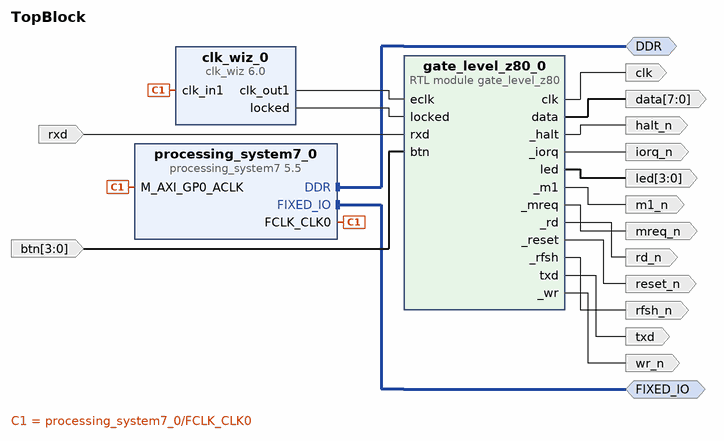
[diagram p0: block diagram of the top level]
# Vivado block design TopBlock, xc7z020clg400-1, Vivado 2019.1
create_bd_design TopBlock

create_bd_intf_port -mode Master -vlnv xilinx.com:interface:ddrx_rtl:1.0 DDR
create_bd_intf_port -mode Master -vlnv xilinx.com:display_processing_system7:fixedio_rtl:1.0 FIXED_IO
create_bd_port -dir O halt_n
create_bd_port -dir O iorq_n
create_bd_port -dir O mreq_n
create_bd_port -dir O m1_n
create_bd_port -dir O rd_n
create_bd_port -dir O rfsh_n
create_bd_port -dir O wr_n
create_bd_port -dir O -from 7 -to 0 data
create_bd_port -dir O -from 3 -to 0 led
create_bd_port -dir I rxd
create_bd_port -dir O reset_n
create_bd_port -dir O txd
create_bd_port -dir O clk
create_bd_port -dir I -from 3 -to 0 btn

create_bd_cell -type ip -vlnv xilinx.com:ip:processing_system7:5.5 processing_system7_0
set_property -dict [list \
  CONFIG.PCW_APU_PERIPHERAL_FREQMHZ 650 \
  CONFIG.PCW_CRYSTAL_PERIPHERAL_FREQMHZ 50 \
  CONFIG.PCW_ENET0_ENET0_IO {MIO 16 .. 27} \
  CONFIG.PCW_ENET0_GRP_MDIO_ENABLE 1 \
  CONFIG.PCW_ENET0_GRP_MDIO_IO {MIO 52 .. 53} \
  CONFIG.PCW_ENET0_PERIPHERAL_ENABLE 1 \
  CONFIG.PCW_ENET0_RESET_ENABLE 1 \
  CONFIG.PCW_ENET0_RESET_IO {MIO 9} \
  CONFIG.PCW_ENET_RESET_ENABLE 1 \
  CONFIG.PCW_ENET_RESET_SELECT {Share reset pin} \
  CONFIG.PCW_FPGA0_PERIPHERAL_FREQMHZ 100 \
  CONFIG.PCW_FPGA1_PERIPHERAL_FREQMHZ 31.25 \
  CONFIG.PCW_GPIO_MIO_GPIO_ENABLE 1 \
  CONFIG.PCW_GPIO_MIO_GPIO_IO MIO \
  CONFIG.PCW_I2C_RESET_ENABLE 1 \
  CONFIG.PCW_M_AXI_GP0_FREQMHZ 10 \
  CONFIG.PCW_PERIPHERAL_BOARD_PRESET None \
  CONFIG.PCW_PRESET_BANK1_VOLTAGE {LVCMOS 1.8V} \
  CONFIG.PCW_QSPI_GRP_FBCLK_ENABLE 1 \
  CONFIG.PCW_QSPI_GRP_FBCLK_IO {MIO 8} \
  CONFIG.PCW_QSPI_GRP_SINGLE_SS_ENABLE 1 \
  CONFIG.PCW_QSPI_GRP_SINGLE_SS_IO {MIO 1 .. 6} \
  CONFIG.PCW_QSPI_PERIPHERAL_ENABLE 1 \
  CONFIG.PCW_QSPI_QSPI_IO {MIO 1 .. 6} \
  CONFIG.PCW_SD0_GRP_CD_ENABLE 1 \
  CONFIG.PCW_SD0_GRP_CD_IO {MIO 47} \
  CONFIG.PCW_SD0_GRP_WP_ENABLE 0 \
  CONFIG.PCW_SD0_PERIPHERAL_ENABLE 1 \
  CONFIG.PCW_SD0_SD0_IO {MIO 40 .. 45} \
  CONFIG.PCW_SDIO_PERIPHERAL_FREQMHZ 50 \
  CONFIG.PCW_SINGLE_QSPI_DATA_MODE x4 \
  CONFIG.PCW_UART0_PERIPHERAL_ENABLE 1 \
  CONFIG.PCW_UART0_UART0_IO {MIO 14 .. 15} \
  CONFIG.PCW_UART1_PERIPHERAL_ENABLE 0 \
  CONFIG.PCW_UART_PERIPHERAL_FREQMHZ 100 \
  CONFIG.PCW_UIPARAM_DDR_BUS_WIDTH {16 Bit} \
  CONFIG.PCW_UIPARAM_DDR_FREQ_MHZ 525 \
  CONFIG.PCW_UIPARAM_DDR_PARTNO {MT41J256M16 RE-125} \
  CONFIG.PCW_USB0_PERIPHERAL_ENABLE 1 \
  CONFIG.PCW_USB0_RESET_ENABLE 1 \
  CONFIG.PCW_USB0_RESET_IO {MIO 46} \
  CONFIG.PCW_USB0_USB0_IO {MIO 28 .. 39} \
  CONFIG.PCW_USB_RESET_ENABLE 1 \
  CONFIG.PCW_USB_RESET_SELECT {Share reset pin} \
] [get_bd_cells processing_system7_0]
# 481 more settings of processing_system7_0 are not shown: defaults, MIO pin electricals, DDR timing, and values the tool derives
create_bd_cell -type ip -vlnv xilinx.com:ip:clk_wiz:6.0 clk_wiz_0
set_property -dict [list \
  CONFIG.CLKOUT1_JITTER 144.481 \
  CONFIG.CLKOUT1_REQUESTED_OUT_FREQ 62.5 \
  CONFIG.MMCM_CLKOUT0_DIVIDE_F 16.000 \
  CONFIG.USE_RESET false \
] [get_bd_cells clk_wiz_0]
create_bd_cell -type module -reference gate_level_z80 gate_level_z80_0

# ---- connections ----

connect_bd_intf_net [get_bd_intf_ports DDR] [get_bd_intf_pins processing_system7_0/DDR]
connect_bd_intf_net [get_bd_intf_ports FIXED_IO] [get_bd_intf_pins processing_system7_0/FIXED_IO]
connect_bd_net [get_bd_pins processing_system7_0/FCLK_CLK0] [get_bd_pins processing_system7_0/M_AXI_GP0_ACLK] [get_bd_pins clk_wiz_0/clk_in1]
connect_bd_net [get_bd_pins gate_level_z80_0/data] [get_bd_ports data]
connect_bd_net [get_bd_pins gate_level_z80_0/_reset] [get_bd_ports reset_n]
connect_bd_net [get_bd_pins gate_level_z80_0/_wr] [get_bd_ports wr_n]
connect_bd_net [get_bd_pins gate_level_z80_0/_rfsh] [get_bd_ports rfsh_n]
connect_bd_net [get_bd_ports rxd] [get_bd_pins gate_level_z80_0/rxd]
connect_bd_net [get_bd_pins gate_level_z80_0/_halt] [get_bd_ports halt_n]
connect_bd_net [get_bd_pins gate_level_z80_0/txd] [get_bd_ports txd]
connect_bd_net [get_bd_pins gate_level_z80_0/led] [get_bd_ports led]
connect_bd_net [get_bd_pins gate_level_z80_0/clk] [get_bd_ports clk]
connect_bd_net [get_bd_pins clk_wiz_0/clk_out1] [get_bd_pins gate_level_z80_0/eclk]
connect_bd_net [get_bd_pins gate_level_z80_0/_m1] [get_bd_ports m1_n]
connect_bd_net [get_bd_pins gate_level_z80_0/_rd] [get_bd_ports rd_n]
connect_bd_net [get_bd_ports btn] [get_bd_pins gate_level_z80_0/btn]
connect_bd_net [get_bd_pins gate_level_z80_0/_mreq] [get_bd_ports mreq_n]
connect_bd_net [get_bd_pins gate_level_z80_0/_iorq] [get_bd_ports iorq_n]
connect_bd_net [get_bd_pins clk_wiz_0/locked] [get_bd_pins gate_level_z80_0/locked]

validate_bd_design
save_bd_design
